# Altium schematic sheet VlakecRemote.SchDoc
size A4
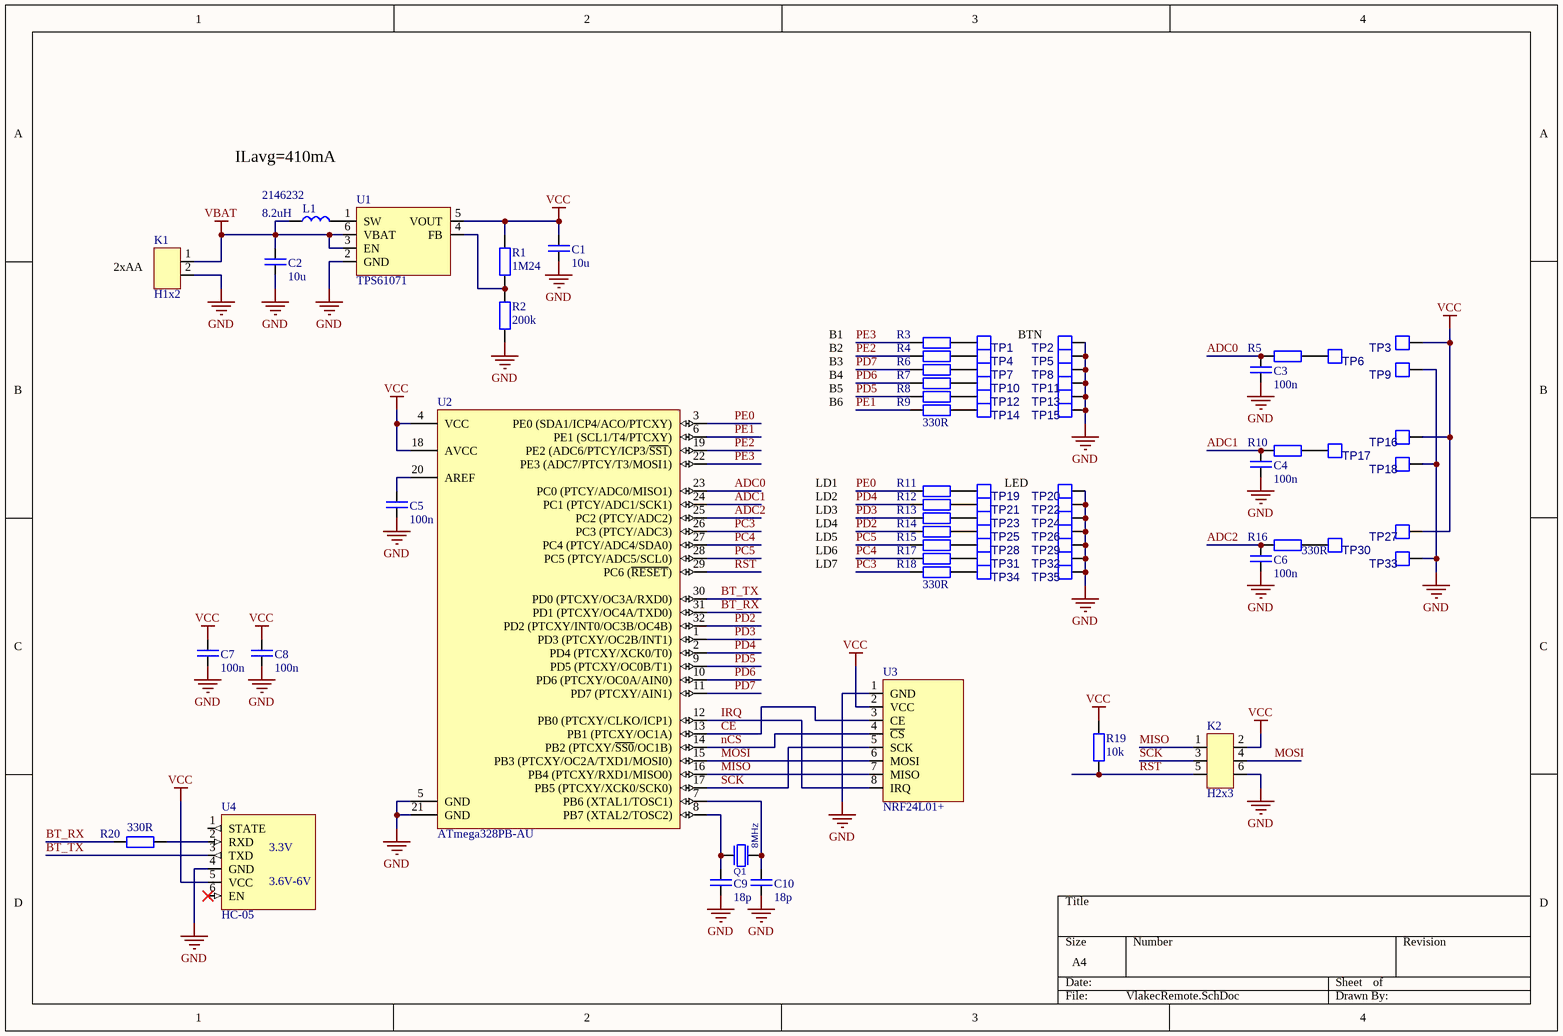
[diagram p0: VlakecRemote.SchDoc]

## Parts
C1  10u  [C1206(3216)_N]
C2  10u  [C1206(3216)_N]
C3  100n  [C0805(2012)_N]
C4  100n  [C0805(2012)_N]
C5  100n  [C0805(2012)_N]
C6  100n  [C0805(2012)_N]
C7  100n  [C0805(2012)_N]
C8  100n  [C0805(2012)_N]
C9  18p  [C0805(2012)_N]
C10  18p  [C0805(2012)_N]
K1  H1x2  [H1x2]
K2  H2x3  [H2X3_SPEEDY]
L1  8.2uH  Supplier Part Number 1: 2146232  [L2424_6060_M]
Q1  8MHz  [Crystal_HC49]
R1  1M24  [R0805(2012)_M]
R2  200k  [R0805(2012)_M]
R3  330R  [R0805(2012)_N]  (value not drawn)
R4  330R  [R0805(2012)_N]  (value not drawn)
R5  330R  [R0805(2012)_N]  (value not drawn)
R6  330R  [R0805(2012)_N]  (value not drawn)
R7  330R  [R0805(2012)_N]  (value not drawn)
R8  330R  [R0805(2012)_N]  (value not drawn)
R9  330R  [R0805(2012)_N]
R10  330R  [R0805(2012)_N]  (value not drawn)
R11  330R  [R0805(2012)_N]  (value not drawn)
R12  330R  [R0805(2012)_N]  (value not drawn)
R13  330R  [R0805(2012)_N]  (value not drawn)
R14  330R  [R0805(2012)_N]  (value not drawn)
R15  330R  [R0805(2012)_N]  (value not drawn)
R16  330R  [R0805(2012)_N]
R17  330R  [R0805(2012)_N]  (value not drawn)
R18  330R  [R0805(2012)_N]
R19  10k  [R0805(2012)_N]
R20  330R  [R0805(2012)_N]
TP1  PAD  [PAD_HOLE]  (value not drawn)
TP2  PAD  [PAD_HOLE]  (value not drawn)
TP3  PAD  [PAD_HOLE]  (value not drawn)
TP4  PAD  [PAD_HOLE]  (value not drawn)
TP5  PAD  [PAD_HOLE]  (value not drawn)
TP6  PAD  [PAD_HOLE]  (value not drawn)
TP7  PAD  [PAD_HOLE]  (value not drawn)
TP8  PAD  [PAD_HOLE]  (value not drawn)
TP9  PAD  [PAD_HOLE]  (value not drawn)
TP10  PAD  [PAD_HOLE]  (value not drawn)
TP11  PAD  [PAD_HOLE]  (value not drawn)
TP12  PAD  [PAD_HOLE]  (value not drawn)
TP13  PAD  [PAD_HOLE]  (value not drawn)
TP14  PAD  [PAD_HOLE]  (value not drawn)
TP15  PAD  [PAD_HOLE]  (value not drawn)
TP16  PAD  [PAD_HOLE]  (value not drawn)
TP17  PAD  [PAD_HOLE]  (value not drawn)
TP18  PAD  [PAD_HOLE]  (value not drawn)
TP19  PAD  [PAD_HOLE]  (value not drawn)
TP20  PAD  [PAD_HOLE]  (value not drawn)
TP21  PAD  [PAD_HOLE]  (value not drawn)
TP22  PAD  [PAD_HOLE]  (value not drawn)
TP23  PAD  [PAD_HOLE]  (value not drawn)
TP24  PAD  [PAD_HOLE]  (value not drawn)
TP25  PAD  [PAD_HOLE]  (value not drawn)
TP26  PAD  [PAD_HOLE]  (value not drawn)
TP27  PAD  [PAD_HOLE]  (value not drawn)
TP28  PAD  [PAD_HOLE]  (value not drawn)
TP29  PAD  [PAD_HOLE]  (value not drawn)
TP30  PAD  [PAD_HOLE]  (value not drawn)
TP31  PAD  [PAD_HOLE]  (value not drawn)
TP32  PAD  [PAD_HOLE]  (value not drawn)
TP33  PAD  [PAD_HOLE]  (value not drawn)
TP34  PAD  [PAD_HOLE]  (value not drawn)
TP35  PAD  [PAD_HOLE]  (value not drawn)
U1  TPS61071  [SOT23-6_N]
U2  ATmega328PB-AU  [32A_N]
U3  NRF24L01+  [NRF24L01+tht_module]
U4  HC-05  [HC05-horizontal-direct]

## Nets
GND: C1.2 C2.2 C3.2 C4.2 C5.2 C6.2 C7.2 C8.2 C9.2 C10.2 K1.2 K2.6 R2.2 TP2.1 TP5.1 TP8.1 TP9.1 TP11.1 TP13.1 TP15.1 TP18.1 TP20.1 TP22.1 TP24.1 TP26.1 TP29.1 TP32.1 TP33.1 TP35.1 U1.2(GND) U2.5(GND) U2.21(GND) U3.1(GND) U4.4(GND)
VBAT: C2.1 K1.1 L1.1 U1.3(EN) U1.6(VBAT)
VCC: C1.1 C7.1 C8.1 K2.2 R1.1 R19.2 TP3.1 TP16.1 TP27.1 U1.5(VOUT) U2.4(VCC) U2.18(AVCC) U3.2(VCC) U4.5(VCC)
ADC0: C3.1 R5.1 U2.23(PC0_(PTCY/ADC0/MISO1))
ADC1: C4.1 R10.1 U2.24(PC1_(PTCY/ADC1/SCK1))
ADC2: C6.1 R16.1 U2.25(PC2_(PTCY/ADC2))
BT_RX: R20.1 U2.31(PD1_(PTCXY/OC4A/TXD0))
BT_TX: U2.30(PD0_(PTCXY/OC3A/RXD0)) U4.3(TXD)
CE: U2.13(PB1_(PTCXY/OC1A)) U3.3(CE)
IRQ: U2.12(PB0_(PTCXY/CLKO/ICP1)) U3.8(IRQ)
MISO: K2.1 U2.16(PB4_(PTCXY/RXD1/MISO0)) U3.7(MISO)
MOSI: K2.4 U2.15(PB3_(PTCXY/OC2A/TXD1/MOSI0)) U3.6(MOSI)
nCS: U2.14(PB2_(PTCXY/~{SS0}/OC1B)) U3.4(~{CS})
PC3: R18.1 U2.26(PC3_(PTCY/ADC3))
PC4: R17.1 U2.27(PC4_(PTCY/ADC4/SDA0))
PC5: R15.1 U2.28(PC5_(PTCY/ADC5/SCL0))
PD2: R14.1 U2.32(PD2_(PTCXY/INT0/OC3B/OC4B))
PD3: R13.1 U2.1(PD3_(PTCXY/OC2B/INT1))
PD4: R12.1 U2.2(PD4_(PTCXY/XCK0/T0))
PD5: R8.1 U2.9(PD5_(PTCXY/OC0B/T1))
PD6: R7.1 U2.10(PD6_(PTCXY/OC0A/AIN0))
PD7: R6.1 U2.11(PD7_(PTCXY/AIN1))
PE0: R11.1 U2.3(PE0_(SDA1/ICP4/ACO/PTCXY))
PE1: R9.1 U2.6(PE1_(SCL1/T4/PTCXY))
PE2: R4.1 U2.19(PE2_(ADC6/PTCY/ICP3/~{SS1}))
PE3: R3.1 U2.22(PE3_(ADC7/PTCY/T3/MOSI1))
RST: K2.5 R19.1 U2.29(PC6_(~{RESET}))
SCK: K2.3 U2.17(PB5_(PTCXY/XCK0/SCK0)) U3.5(SCK)
NetC5_1: C5.1 U2.20(AREF)
NetC9_1: C9.1 Q1.1 U2.8(PB7_(XTAL2/TOSC2))
NetC10_1: C10.1 Q1.2 U2.7(PB6_(XTAL1/TOSC1))
NetL1_2: L1.2 U1.1(SW)
NetR1_2: R1.2 R2.1 U1.4(FB)
NetR3_2: R3.2 TP1.1
NetR4_2: R4.2 TP4.1
NetR5_2: R5.2 TP6.1
NetR6_2: R6.2 TP7.1
NetR7_2: R7.2 TP10.1
NetR8_2: R8.2 TP12.1
NetR9_2: R9.2 TP14.1
NetR10_2: R10.2 TP17.1
NetR11_2: R11.2 TP19.1
NetR12_2: R12.2 TP21.1
NetR13_2: R13.2 TP23.1
NetR14_2: R14.2 TP25.1
NetR15_2: R15.2 TP28.1
NetR16_2: R16.2 TP30.1
NetR17_2: R17.2 TP31.1
NetR18_2: R18.2 TP34.1
NetR20_2: R20.2 U4.2(RXD)

Not connected (* = marked no-connect by the designer): U4 1(STATE) 6(EN)*

## Notes on the sheet
- ILavg=410mA
- (near K1) 2xAA
- B1
- B2
- B3
- B4
- BTN
- B5
- B6
- LD1
- LD2
- LD3
- LED
- LD4
- LD5
- LD6
- LD7
- (in symbol HC-05) 3.3V; 3.6V-6V

## Library data of the parts
C1-C10 = C: Capacitor
K1 = H1x2: Header 1x2 (male)
K2 = H2x3: Header 2x3 (male)
L1 = L: Supplier 1: Farnell
Q1 = Crystal
R1-R20 = R
U1 = TPS61071: Sync. Boost converter
U2 = ATmega328PB-AU: 8-bit AVR Microcontroller, 32KB Flash, 1KB EEPROM, 2KB SRAM, 32-pin TQFP, Industrial Grade (-40°C to 85°C); DatasheetVersion: revC, Oct-2015; PackageReference: 32A; PackageDescription: 32-Lead, 7x7x1.0 mm Body, 0.8mm Lead Pitch, Thin Profile Plastic Quad Flat Package (TQFP); Code_JEDEC: MS-026-ABA; ComponentLink1Description: Manufacturer URL; ComponentLink1URL: http://www.atmel.com/; ComponentLink2Description: ATmega328PB Datasheet; ComponentLink2URL: http://www.atmel.com/Images/Atmel-42397-8-bit-AVR-Microcontroller-ATmega328PB_Datasheet.pdf; ComponentLink3Description: ATmega328P Summary; ComponentLink3URL: http://www.atmel.com/Images/Atmel-42397-8-bit-AVR-Microcontroller-ATmega328PB_Summary.pdf